# EAGLE design instrumentacion-eeg (EAGLE 9.6.2)
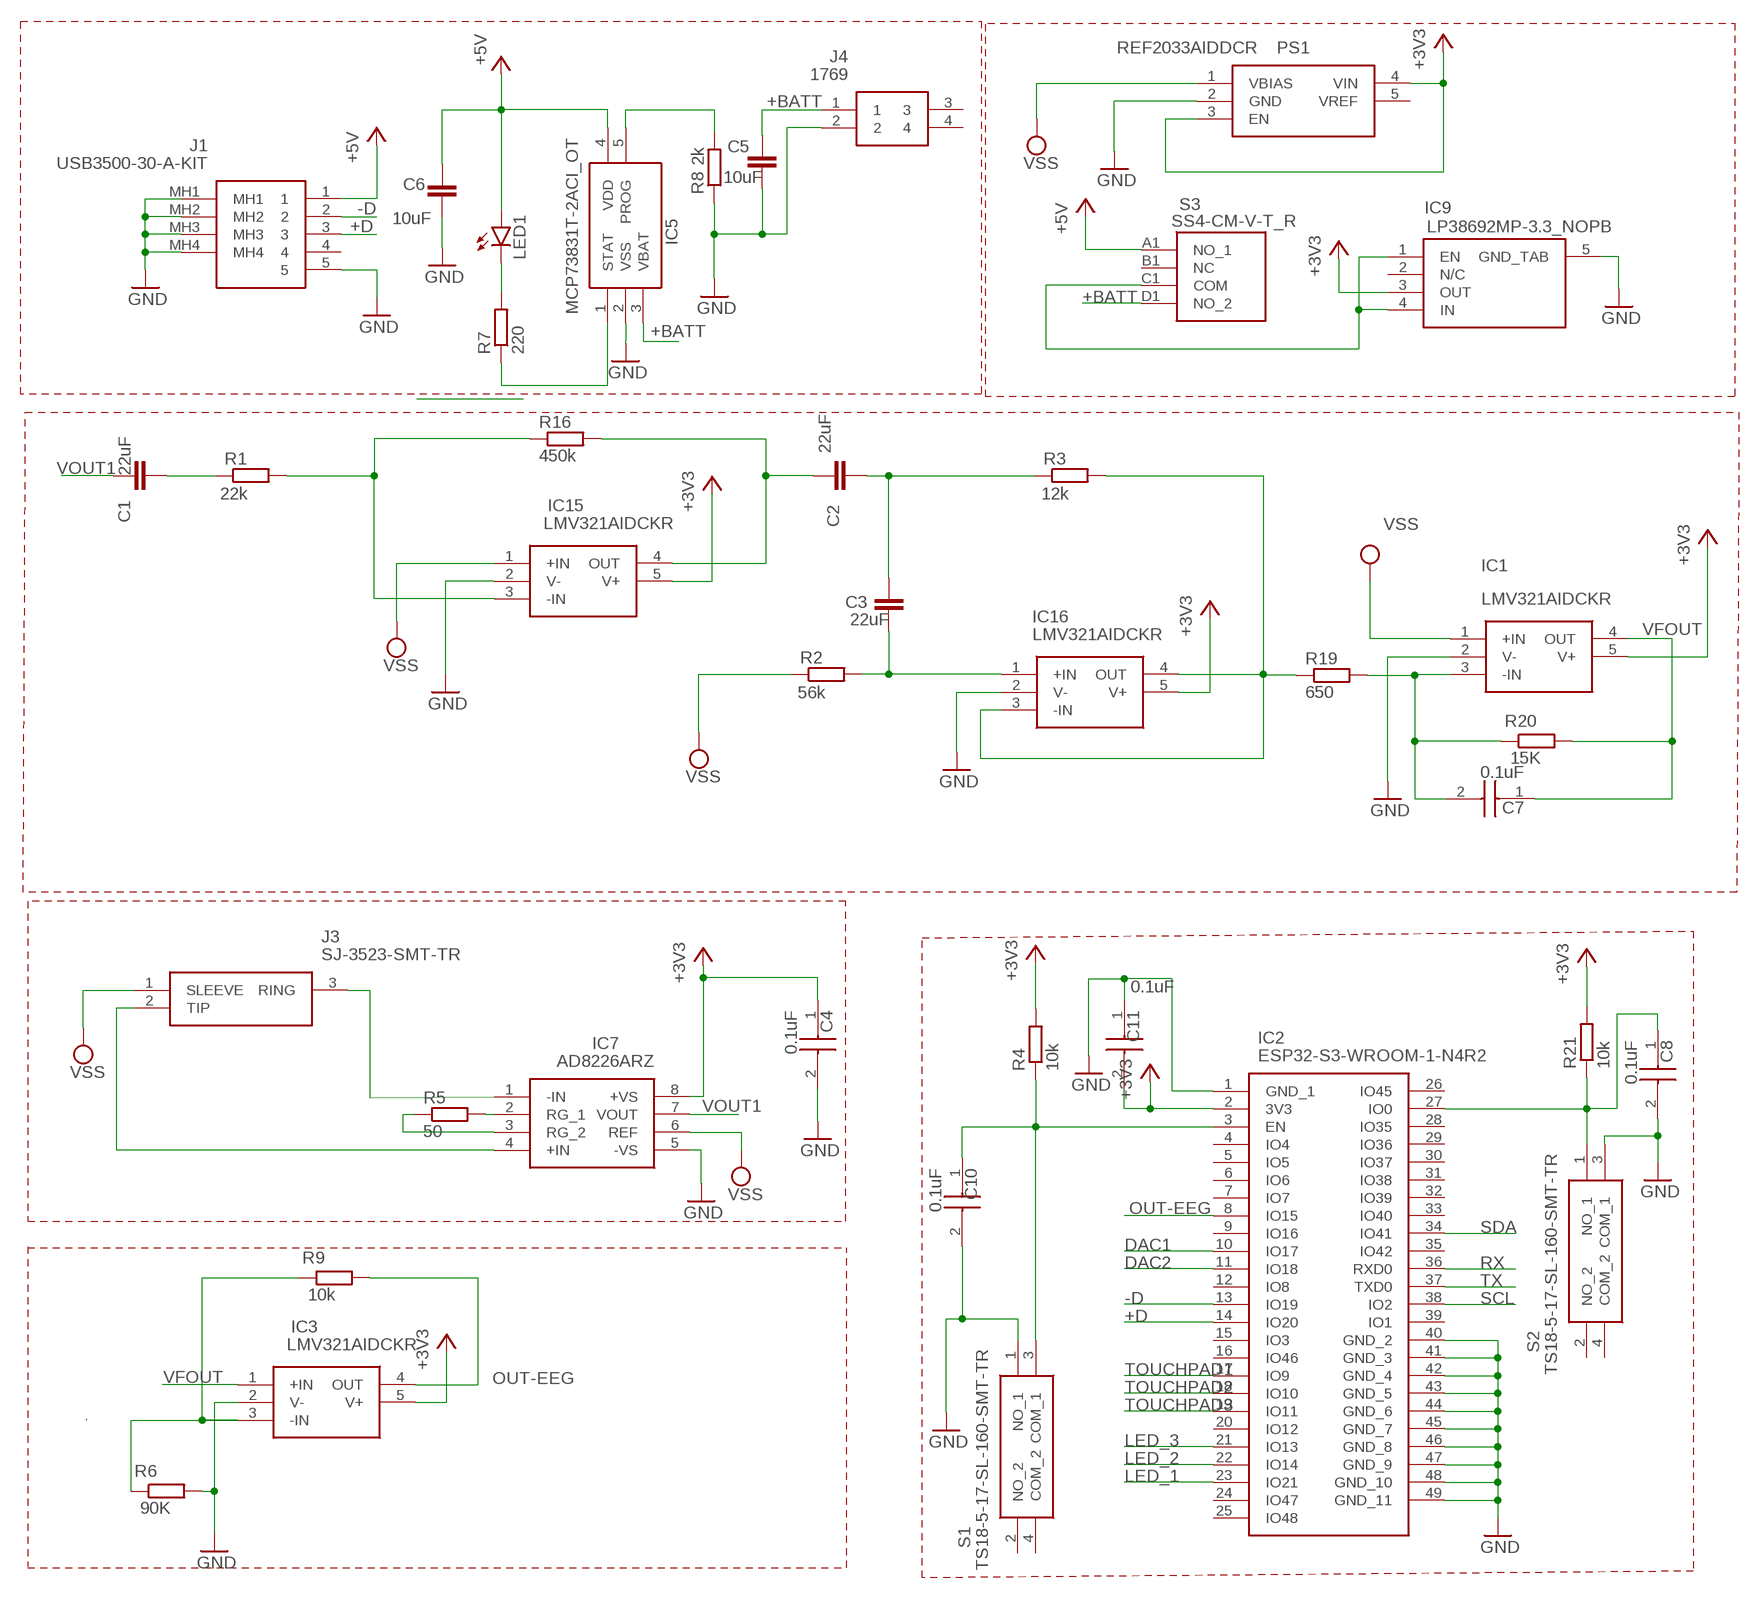
[diagram p0: schematic, sheet 1]

## Parts
C1  C-EUC0805  [C0805]
C2  C-EUC0805  [C0805]
C3  C-EUC0805  [C0805]
C4  0.1uF  GCM21B5C2A393JE02L  [CAPC2012X140N]
C5  C-EUC0805  [C0805]
C6  C-EUC0805  [C0805]
C7  0.1uF  GCM21B5C2A393JE02L  [CAPC2012X140N]
C8  0.1uF  GCM21B5C2A393JE02L  [CAPC2012X140N]
C10  0.1uF  GCM21B5C2A393JE02L  [CAPC2012X140N]
C11  0.1uF  GCM21B5C2A393JE02L  [CAPC2012X140N]
IC1  LMV321AIDCKR  [SOT65P210X110-5N]
IC2  ESP32-S3-WROOM-1-N4R2  [ESP32S3WROOM1N4R2]
IC3  LMV321AIDCKR  [SOT65P210X110-5N]
IC5  MCP73831T-2ACI_OT  [SOT95P270X145-5N]
IC7  AD8226ARZ  [SOIC127P600X175-8N]
IC9  LP38692MP-3.3_NOPB  [SOT150P700X180-5N]
IC15  LMV321AIDCKR  [SOT65P210X110-5N]
IC16  LMV321AIDCKR  [SOT65P210X110-5N]
J1  USB3500-30-A-KIT  [USB350030AKIT]
J3  SJ-3523-SMT-TR  [SJ3523SMTTR]
J4  1769  [1769]
LED1  LEDCHIP-LED0805  [CHIP-LED0805]
PS1  REF2033AIDDCR  [SOT95P280X110-5N]
R1  R-EU_R0805  [R0805]
R2  R-EU_R0805  [R0805]
R3  R-EU_R0805  [R0805]
R4  10k  R-EU_R0805  [R0805]
R5  50  R-EU_R0805  [R0805]
R6  90K  R-EU_R0805  [R0805]
R7  220  R-EU_R0805  [R0805]
R8  2k  R-EU_R0805  [R0805]
R9  10k  R-EU_R0805  [R0805]
R16  450k  R-EU_R0805  [R0805]
R19  650  R-EU_R0805  [R0805]
R20  15K  R-EU_R0805  [R0805]
R21  10k  R-EU_R0805  [R0805]
S1  TS18-5-17-SL-160-SMT-TR  [TS18517SL160SMTTR]
S2  TS18-5-17-SL-160-SMT-TR  [TS18517SL160SMTTR]
S3  SS4-CM-V-T_R  [SS4CMVTR]

## Nets
+3V3: C4.1 C11.2 IC1.5(V+) IC2.2(3V3) IC3.5(V+) IC7.8(+VS) IC9.3(OUT) IC15.5(V+) IC16.5(V+) PS1.3(EN) PS1.4(VIN) R4.2 R21.2
+5V: C6.2 IC5.4(VDD) J1.1 LED1.A S3.A1(NO_1)
+BATT: C5.2 IC5.3(VBAT) J4.1 S3.D1(NO_2)
+D: IC2.14(IO20) J1.3
-D: IC2.13(IO19) J1.2
DAC1: IC2.10(IO17)
DAC2: IC2.11(IO18)
GND: C4.2 C5.1 C6.1 C8.2 C10.2 C11.1 IC1.2(V-) IC2.1(GND_1) IC2.40(GND_2) IC2.41(GND_3) IC2.42(GND_4) IC2.43(GND_5) IC2.44(GND_6) IC2.45(GND_7) IC2.46(GND_8) IC2.47(GND_9) IC2.48(GND_10) IC2.49(GND_11) IC3.2(V-) IC5.2(VSS) IC7.5(-VS) IC9.5(GND_TAB) IC15.2(V-) IC16.2(V-) J1.5 J1.MH1 J1.MH2 J1.MH3 J1.MH4 J4.2 PS1.2(GND) R6.2 R8.1 S1.1(NO_1) S2.3(COM_1)
LED_1: IC2.23(IO21)
LED_2: IC2.22(IO14)
LED_3: IC2.21(IO13)
N$1: IC7.4(+IN) J3.2(TIP)
N$2: C1.2 R1.1
N$3: C3.1 IC16.1(+IN) R2.2
N$4: C2.2 C3.2 R3.1
N$5: C10.1 IC2.3(EN) R4.1 S1.3(COM_1)
N$6: IC16.3(-IN) IC16.4(OUT) R3.2 R19.1
N$9: C7.2 IC1.3(-IN) R19.2 R20.1
N$10: IC7.2(RG_1) R5.2
N$11: IC7.1(-IN) J3.3(RING)
N$12: IC7.3(RG_2) R5.1
N$13: C8.1 IC2.27(IO0) R21.1 S2.1(NO_1)
N$14: IC3.3(-IN) R6.1 R9.1
N$17: IC5.5(PROG) R8.2
N$19: IC5.1(STAT) R7.1
N$20: LED1.C R7.2
N$31: IC9.1(EN) IC9.4(IN) S3.C1(COM)
N$46: IC15.3(-IN) R1.2 R16.1
N$47: C2.1 IC15.4(OUT) R16.2
OUT-EEG: IC2.8(IO15) IC3.4(OUT) R9.2
RX: IC2.36(RXD0)
SCL: IC2.38(IO2)
SDA: IC2.34(IO41)
TOUCHPAD1: IC2.17(IO9)
TOUCHPAD2: IC2.18(IO10)
TOUCHPAD3: IC2.19(IO11)
TX: IC2.37(TXD0)
VFOUT: C7.1 IC1.4(OUT) IC3.1(+IN) R20.2
VOUT1: C1.1 IC7.7(VOUT)
VSS: IC1.1(+IN) IC7.6(REF) IC15.1(+IN) J3.1(SLEEVE) PS1.1(VBIAS) R2.1
Unconnected: IC2.4(IO4) IC2.5(IO5) IC2.6(IO6) IC2.7(IO7) IC2.9(IO16) IC2.12(IO8) IC2.15(IO3) IC2.16(IO46) IC2.20(IO12) IC2.24(IO47) IC2.25(IO48) IC2.26(IO45) IC2.28(IO35) IC2.29(IO36) IC2.30(IO37) IC2.31(IO38) IC2.32(IO39) IC2.33(IO40) IC2.35(IO42) IC2.39(IO1) IC9.2(N/C) J1.4 J4.3 J4.4 PS1.5(VREF) S1.2(NO_2) S1.4(COM_2) S2.2(NO_2) S2.4(COM_2) S3.B1(NC)

## Library data of the parts
C1-C3 C5 C6 = rcl:C-EU: CAPACITOR, European symbol; SPICEPREFIX: C
C4 C7 C8 C10 C11 = GCM21B5C2A393JE02L:GCM21B5C2A393JE02L: This specification is applied to Chip Multilayer Ceramic Capacitors. 1.Specific applications: Automotive Powertrain/Safety Equipment: Products that can be used for automotive equipment related to running, turning, stopping, safety devices, etc., or equipment whose structure, equipment, and performance are legally required to meet technical standards for safety assurance or environmental protection. Automotive Infotainment/Comfort Equipment: Products that can be used for automotive equipment such as c Source: Datasheet <https://search.murata.co.jp/Ceramy/image/img/A01X/G101/ENG/GCM21B5C2A393JE02-01A.pdf>; DESCRIPTION: This specification is applied to Chip Multilayer Ceramic Capacitors. 1.Specific applications: Automotive Powertrain/Safety Equipment: Products that can be used for automotive equipment related to running, turning, stopping, safety devices, etc., or equipment whose structure, equipment, and performance are legally required to meet technical standards for safety assurance or environmental protection. Automotive Infotainment/Comfort Equipment: Products that can be used for automotive equipment such as c; HEIGHT: 1.4mm; MANUFACTURER_NAME: Murata Electronics; MANUFACTURER_PART_NUMBER: GCM21B5C2A393JE02L; MOUSER_PART_NUMBER: 81-GCM21B5C2A393JE2L; MOUSER_PRICE-STOCK: https://www.mouser.co.uk/ProductDetail/Murata-Electronics/GCM21B5C2A393JE02L?qs=efUn273yAheACf9Thh026A%3D%3D
IC1 IC3 IC15 IC16 = LMV321AIDCKR:LMV321AIDCKR: Single Low-Voltage, Cost-Optimized Rail-to-Rail Output Operational Amplifier Source: Datasheet <http://www.ti.com/lit/gpn/LMV321A>; DESCRIPTION: Single Low-Voltage, Cost-Optimized Rail-to-Rail Output Operational Amplifier; HEIGHT: 1.1mm; MANUFACTURER_NAME: Texas Instruments; MANUFACTURER_PART_NUMBER: LMV321AIDCKR; MOUSER_PART_NUMBER: 595-LMV321AIDCKR; MOUSER_PRICE-STOCK: https://www.mouser.co.uk/ProductDetail/Texas-Instruments/LMV321AIDCKR?qs=%252BEew9%252B0nqrDxZ%2F4fDfzAtQ%3D%3D
IC2 = ESP32-S3-WROOM-1-N4R2:ESP32-S3-WROOM-1-N4R2: Bluetooth, WiFi 802.11b/g/n, Bluetooth v5.0 Transceiver Module 2.4GHz PCB Trace Surface Mount , 3V ~ 3.6V , 285mA ~ 355mA , -40C ~ 85C (TA) Source: Datasheet <https://www.espressif.com/sites/default/files/documentation/esp32-s3-wroom-1_wroom-1u_datasheet_en.pdf>; DESCRIPTION: Bluetooth, WiFi 802.11b/g/n, Bluetooth v5.0 Transceiver Module 2.4GHz PCB Trace Surface Mount , 3V ~ 3.6V , 285mA ~ 355mA , -40C ~ 85C (TA); HEIGHT: 3.25mm; MANUFACTURER_NAME: Espressif Systems; MANUFACTURER_PART_NUMBER: ESP32-S3-WROOM-1-N4R2; MOUSER_PART_NUMBER: 356-ESP32S3WROM1N4R2; MOUSER_PRICE-STOCK: https://www.mouser.co.uk/ProductDetail/Espressif-Systems/ESP32-S3-WROOM-1-N4R2?qs=Li%252BoUPsLEns3eX9krmrDyw%3D%3D
IC5 = MCP73831T-2ACI_OT:MCP73831T-2ACI_OT: Li-Ion Charge Controller 4.2V SOT23-5 Source: Datasheet <http://ww1.microchip.com/downloads/en/DeviceDoc/20001984g.pdf>; DESCRIPTION: Li-Ion Charge Controller 4.2V SOT23-5; HEIGHT: 1.45mm; MANUFACTURER_NAME: Microchip; MANUFACTURER_PART_NUMBER: MCP73831T-2ACI/OT; MOUSER_PART_NUMBER: 579-MCP73831T-2ACIOT; MOUSER_PRICE-STOCK: https://www.mouser.co.uk/ProductDetail/Microchip-Technology/MCP73831T-2ACI-OT?qs=yUQqVecv4qvbBQBGbHx0Mw%3D%3D
IC7 = AD8226ARZ:AD8226ARZ: Wide Supply Range, Rail-to-Rail Output Instrumentation Amplifier Source: Datasheet <http://componentsearchengine.com/Datasheets/3/AD8226ARZ.pdf>; DESCRIPTION: Wide Supply Range, Rail-to-Rail Output Instrumentation Amplifier; HEIGHT: 1.75mm; MANUFACTURER_NAME: Analog Devices; MANUFACTURER_PART_NUMBER: AD8226ARZ; MOUSER_PART_NUMBER: 584-AD8226ARZ; MOUSER_PRICE-STOCK: https://www.mouser.co.uk/ProductDetail/Analog-Devices/AD8226ARZ?qs=%2FtpEQrCGXCzihJADRPlhCg%3D%3D
IC9 = LP38692MP-3.3_NOPB:LP38692MP-3.3_NOPB: LP38692MP-3.3/NOPB, Low Dropout Voltage Regulator, 1A, 3.3 V +/-2.5%, 2.7 10 Vin, 5-Pin SOT-223 Source: Datasheet <http://www.ti.com/lit/ds/symlink/lp38692.pdf>; DESCRIPTION: LP38692MP-3.3/NOPB, Low Dropout Voltage Regulator, 1A, 3.3 V +/-2.5%, 2.7 10 Vin, 5-Pin SOT-223; HEIGHT: 1.8mm; MANUFACTURER_NAME: Texas Instruments; MANUFACTURER_PART_NUMBER: LP38692MP-3.3/NOPB; MOUSER_PART_NUMBER: 926-LP38692MP3.3NOPB; MOUSER_PRICE-STOCK: https://www.mouser.co.uk/ProductDetail/Texas-Instruments/LP38692MP-3.3-NOPB?qs=1FNqv8aZn1TpKuOP2NKBdg%3D%3D
J1 = USB3500-30-A-KIT:USB3500-30-A-KIT: USB Connectors Micro B Skt, Mid Mount-SMT, R/A, 30u", With Peg, T&R, IP67 + USBTJ-02 Gasket Source: Datasheet <https://gct.co/files/drawings/usb3500.pdf>; DESCRIPTION: USB Connectors Micro B Skt, Mid Mount-SMT, R/A, 30u", With Peg, T&R, IP67 + USBTJ-02 Gasket; HEIGHT: 2.8mm; MANUFACTURER_NAME: GCT (GLOBAL CONNECTOR TECHNOLOGY); MANUFACTURER_PART_NUMBER: USB3500-30-A-KIT; MOUSER_PART_NUMBER: 640-USB3500-30-A-KIT; MOUSER_PRICE-STOCK: https://www.mouser.co.uk/ProductDetail/GCT/USB3500-30-A-KIT?qs=KUoIvG%2F9IlZmD2kH2DfgYg%3D%3D
J3 = SJ-3523-SMT-TR:SJ-3523-SMT-TR: 3.5 mm, Stereo, Right Angle, Surface Mount (SMT), 3 Conductors, 0 Internal Switches, Audio Jack Connector Source: Datasheet <https://www.sameskydevices.com/product/resource/supplyframepdf/sj-352x-smt.pdf>; DESCRIPTION: 3.5 mm, Stereo, Right Angle, Surface Mount (SMT), 3 Conductors, 0 Internal Switches, Audio Jack Connector; HEIGHT: 5.2mm; MANUFACTURER_NAME: Same Sky; MANUFACTURER_PART_NUMBER: SJ-3523-SMT-TR; MOUSER_PART_NUMBER: 490-SJ-3523-SMT-TR; MOUSER_PRICE-STOCK: https://www.mouser.co.uk/ProductDetail/CUI-Devices/SJ-3523-SMT-TR?qs=WyjlAZoYn51zOHzJ3r4ZRA%3D%3D
J4 = 1769:1769: Adafruit Accessories JST-PH 2-pin SMT Right Angle Connect Source: Datasheet <https://cdn-shop.adafruit.com/datasheets/17311.pdf>; ARROW_PART_NUMBER: 1769; ARROW_PRICE-STOCK: https://www.arrow.com/en/products/1769/adafruit-industries?utm_currency=USD&region=nac; DESCRIPTION: Adafruit Accessories JST-PH 2-pin SMT Right Angle Connect; HEIGHT: 5.5mm; MANUFACTURER_NAME: Adafruit; MANUFACTURER_PART_NUMBER: 1769; MOUSER_PART_NUMBER: 485-1769; MOUSER_PRICE-STOCK: https://www.mouser.co.uk/ProductDetail/Adafruit/1769?qs=GURawfaeGuBbgoGtf2XstA%3D%3D
LED1 = led:LED: LED OSRAM: - CHIPLED LG R971, LG N971, LY N971, LG Q971, LY Q971, LO R971, LY R971 LH N974, LH R974 LS Q976, LO Q976, LY Q976 LO Q996 - Hyper CHIPLED LW Q18S LB Q993, LB Q99A, LB R99A - SideLED LS A670, LO A670, LY A670, LG A670, LP A670 LB A673, LV A673, LT A673, LW A673 LH A674 LY A675 LS A676, LA A676, LO A676, LY A676, LW A676 LS A679, LY A679, LG A679 - Hyper Micro SIDELED® LS Y876, LA Y876, LO Y876, LY Y876 LT Y87S - SmartLED LW L88C, LW L88S LB L89C, LB L89S, LG L890 LS L89K, LO L89K, LY L89K LS L896, LA L896, LO L896, LY L896 - TOPLED LS T670, LO T670, LY T670, LG T670, LP T670 LSG T670, LSP T670, LSY T670, LOP T670, LYG T670 LG T671, LOG T671, LSG T671 LB T673, LV T673, LT T673, LW T673 LH T674 LS T676, LA T676, LO T676, LY T676, LB T676, LH T676, LSB T676, LW T676 LB T67C, LV T67C, LT T67C, LS T67K, LO T67K, LY T67K, LW E67C LS E67B, LA E67B, LO E67B, LY E67B, LB E67C, LV E67C, LT E67C LW T67C LS T679, LY T679, LG T679 LS T770, LO T770, LY T770, LG T770, LP T770 LB T773, LV T773, LT T773, LW T773 LH T774 LS E675, LA E675, LY E675, LS T675 LS T776, LA T776, LO T776, LY T776, LB T776 LHGB T686 LT T68C, LB T68C - Hyper Mini TOPLED® LB M676 - Mini TOPLED Santana® LG M470 LS M47K, LO M47K, LY M47K Source: http://www.osram.convergy.de LUXEON: - LUMILED® LXK2-PW12-R00, LXK2-PW12-S00, LXK2-PW14-U00, LXK2-PW14-V00 LXK2-PM12-R00, LXK2-PM12-S00, LXK2-PM14-U00 LXK2-PE12-Q00, LXK2-PE12-R00, LXK2-PE12-S00, LXK2-PE14-T00, LXK2-PE14-U00 LXK2-PB12-K00, LXK2-PB12-L00, LXK2-PB12-M00, LXK2-PB14-N00, LXK2-PB14-P00, LXK2-PB14-Q00 LXK2-PR12-L00, LXK2-PR12-M00, LXK2-PR14-Q00, LXK2-PR14-R00 LXK2-PD12-Q00, LXK2-PD12-R00, LXK2-PD12-S00 LXK2-PH12-R00, LXK2-PH12-S00 LXK2-PL12-P00, LXK2-PL12-Q00, LXK2-PL12-R00 Source: www.luxeon.com KINGBRIGHT: KA-3528ASYC Source: www.kingbright.com
PS1 = REF2033AIDDCR:REF2033AIDDCR: Low-Drift, Low-Power, Dual-Output Vref and Vref/2 Voltage Reference Source: Datasheet <http://www.ti.com/lit/ds/symlink/ref2033.pdf>; DESCRIPTION: Low-Drift, Low-Power, Dual-Output Vref and Vref/2 Voltage Reference; HEIGHT: 1.1mm; MANUFACTURER_NAME: Texas Instruments; MANUFACTURER_PART_NUMBER: REF2033AIDDCR; MOUSER_PART_NUMBER: 595-REF2033AIDDCR; MOUSER_PRICE-STOCK: https://www.mouser.co.uk/ProductDetail/Texas-Instruments/REF2033AIDDCR?qs=7z%252BmIopC6%2FKHHOBVNaL7UQ%3D%3D
R1-R9 R16 R19-R21 = rcl:R-EU_: RESISTOR, European symbol; SPICEPREFIX: R
S1 = TS18-5-17-SL-160-SMT-TR:TS18-5-17-SL-160-SMT-TR: 5 x 5 mm, 1.7 mm Actuator Height, 160 gf, Silver, Surface Mount, TR, SPST, Tactile Switch Source: Datasheet <https://www.sameskydevices.com/product/resource/supplyframepdf/ts18.pdf>; DESCRIPTION: 5 x 5 mm, 1.7 mm Actuator Height, 160 gf, Silver, Surface Mount, TR, SPST, Tactile Switch; HEIGHT: 1.8mm; MANUFACTURER_NAME: Same Sky; MANUFACTURER_PART_NUMBER: TS18-5-17-SL-160-SMT-TR; MOUSER_PART_NUMBER: 179-TS18517SL160SMTT; MOUSER_PRICE-STOCK: https://www.mouser.co.uk/ProductDetail/CUI-Devices/TS18-5-17-SL-160-SMT-TR?qs=tlsG%2FOw5FFhWy38y3t272A%3D%3D
S2 = TS18-5-17-SL-160-SMT-TR:TS18-5-17-SL-160-SMT-TR: 5 x 5 mm, 1.7 mm Actuator Height, 160 gf, Silver, Surface Mount, TR, SPST, Tactile Switch Source: Datasheet <https://www.sameskydevices.com/product/resource/supplyframepdf/ts18.pdf>; DESCRIPTION: FLASH; HEIGHT: 1.8mm; MANUFACTURER_NAME: Same Sky; MANUFACTURER_PART_NUMBER: TS18-5-17-SL-160-SMT-TR; MOUSER_PART_NUMBER: 179-TS18517SL160SMTT; MOUSER_PRICE-STOCK: https://www.mouser.co.uk/ProductDetail/CUI-Devices/TS18-5-17-SL-160-SMT-TR?qs=tlsG%2FOw5FFhWy38y3t272A%3D%3D
S3 = SS4-CM-V-T_R:SS4-CM-V-T_R: Slide Switches Slide Type 1P3T (2.0mm height) Source: Datasheet <https://componentsearchengine.com/Datasheets/1/SS4-CM-V-T_R.pdf>; DESCRIPTION: Slide Switches Slide Type 1P3T (2.0mm height); HEIGHT: 2mm; MANUFACTURER_NAME: Diptronics; MANUFACTURER_PART_NUMBER: SS4-CM-V-T/R; MOUSER_PART_NUMBER: 113-SS4CMVTR; MOUSER_PRICE-STOCK: https://www.mouser.co.uk/ProductDetail/Diptronics/SS4-CM-V-T-R?qs=MLItCLRbWswqNEU%2F6grMKg%3D%3D

## Module NOINVERSOR
Ports: 

### Library data of the parts

## Board
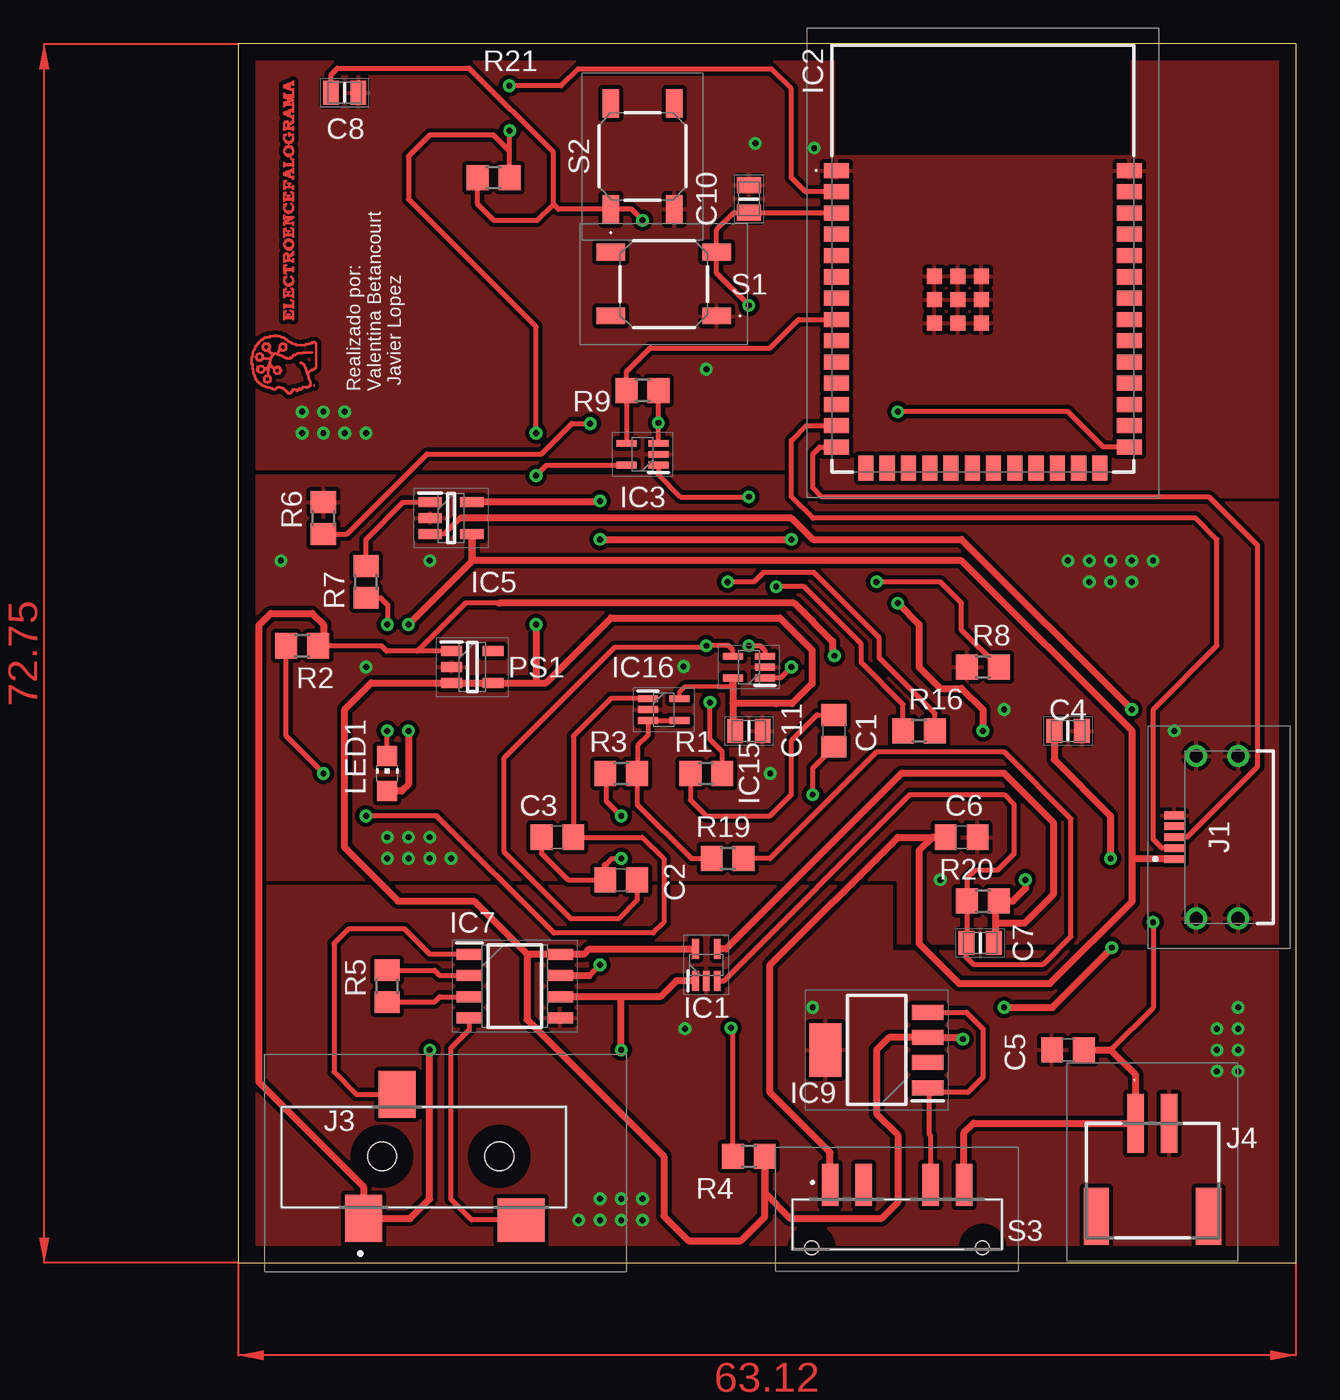
[diagram p1: board, top side]
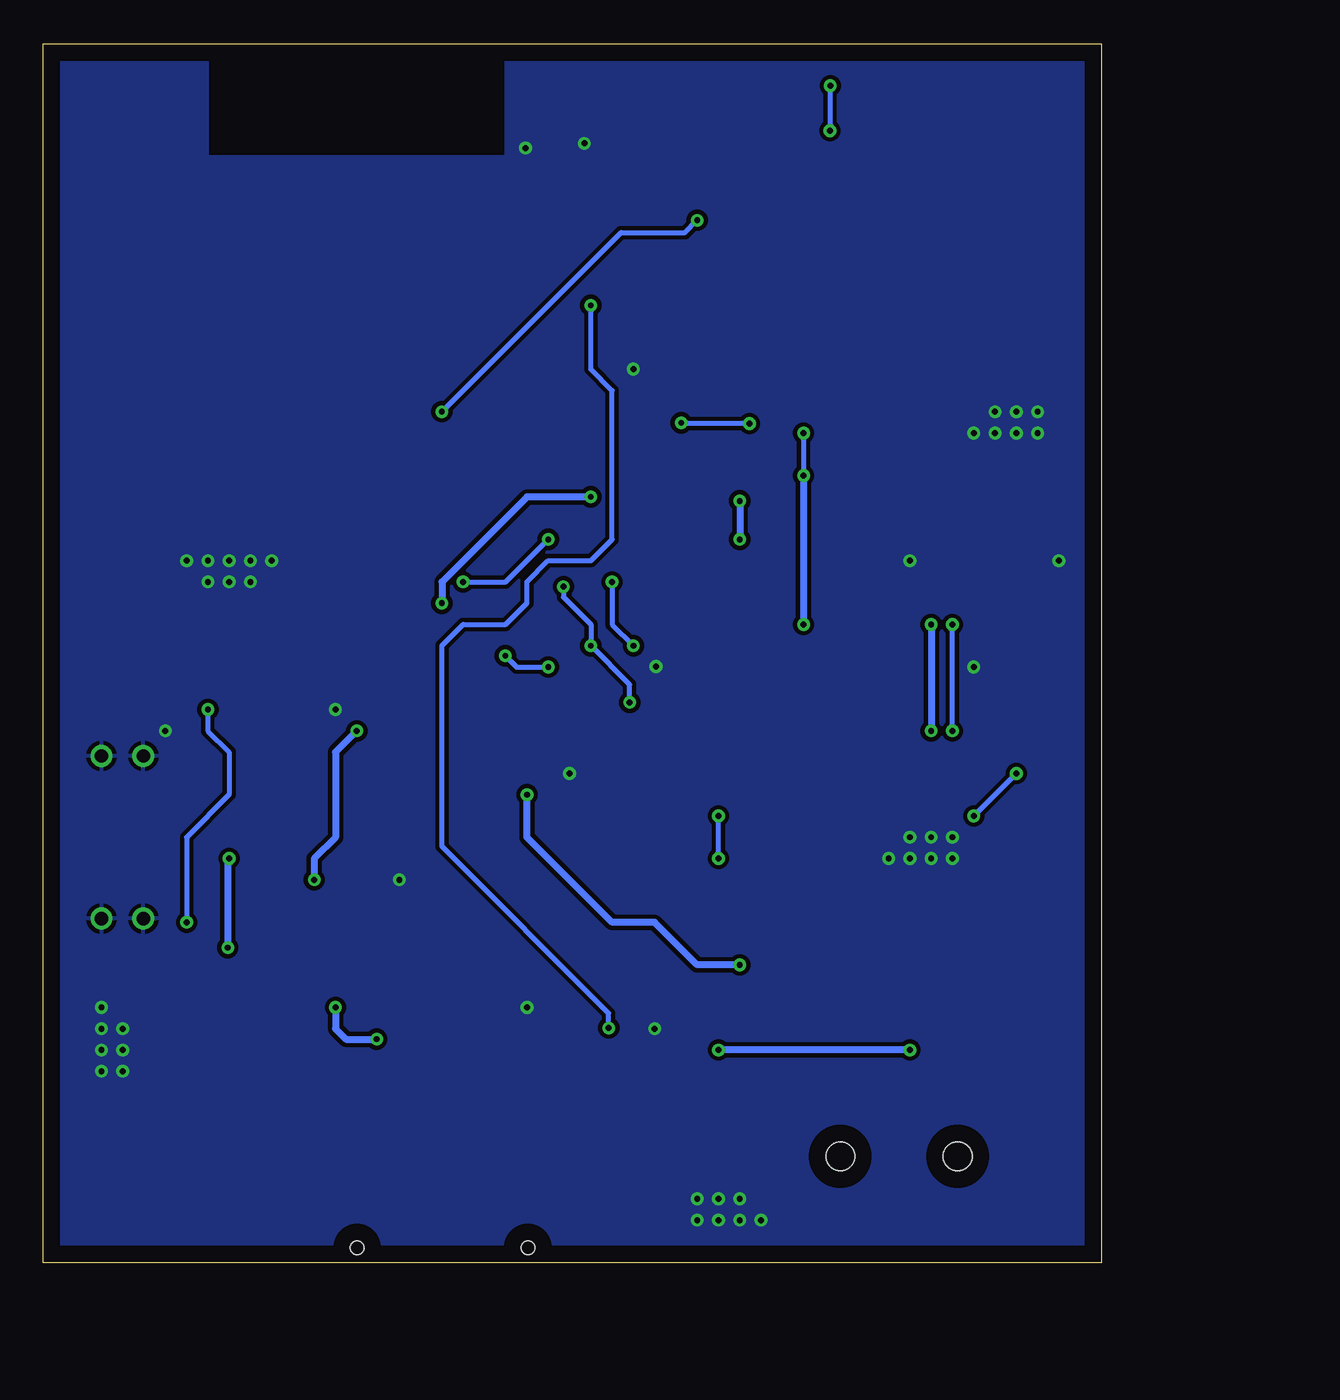
[diagram p2: board, bottom side, seen from below]

Size 63.17 x 72.76 mm. Coordinates in mm from the lower left corner, seen from the top.
Outline: 0,0 63.17,0 63.16,72.76 0,72.76 0,0
Copper layers (1*16): Top 0.035mm / dielectric 1.5mm / Bottom 0.035mm
Design rules "default": minimum track width 6mil, minimum drill 0.35mm, track to track 6mil, track to pad 6mil, pad to pad 6mil, via to via 6mil, smd to smd 6mil, copper to edge 40mil, drill to drill 6mil, minimum pad ring 10mil, minimum via ring 8mil, stop-mask expansion 4mil, vias tented up to drill 0mil, thermal gap 10mil

### Footprints (pad centres in the part's own frame; a part is rotated, then mirrored left to right if it is on the bottom)
C0805 = smd 1.3 x 1.5: 1 -0.95,0; 2 0.95,0
CAPC2012X140N = smd 0.94 x 1.43: 1 -0.82,0; 2 0.82,0
SOT65P210X110-5N = smd 1.2 x 0.4: 1 -0.95,0.65; 2 -0.95,0; 3 -0.95,-0.65; 4 0.95,-0.65; 5 0.95,0.65
ESP32S3WROOM1N4R2 = smd 1.5 x 0.9: 1 -8.75,5.51; 2 -8.75,4.24; 3 -8.75,2.97; 4 -8.75,1.7; 5 -8.75,0.43; 6 -8.75,-0.84; 7 -8.75,-2.11; 8 -8.75,-3.38; 9 -8.75,-4.65; 10 -8.75,-5.92; 11 -8.75,-7.19; 12 -8.75,-8.46; 13 -8.75,-9.73; 14 -8.75,-11; 27 8.75,-11; 28 8.75,-9.73; 29 8.75,-8.46; 30 8.75,-7.19; 31 8.75,-5.92; 32 8.75,-4.65; 33 8.75,-3.38; 34 8.75,-2.11; 35 8.75,-0.84; 36 8.75,0.43; 37 8.75,1.7; 38 8.75,2.97; 39 8.75,4.24; 40 8.75,5.51 | smd 0.9 x 1.5: 15 -6.985,-12.25; 16 -5.715,-12.25; 17 -4.445,-12.25; 18 -3.175,-12.25; 19 -1.905,-12.25; 20 -0.635,-12.25; 21 0.635,-12.25; 22 1.905,-12.25; 23 3.175,-12.25; 24 4.445,-12.25; 25 5.715,-12.25; 26 6.985,-12.25 | smd 0.9 x 0.9: 41 -1.5,-2.21; 42 -0.1,-2.21; 43 -0.1,-0.81; 44 -1.5,-0.81; 45 -2.9,-0.81; 46 -2.9,-2.21; 47 -2.9,-3.61; 48 -1.5,-3.61; 49 -0.1,-3.61
SOT95P270X145-5N = smd 1.4 x 0.6: 1 -1.25,0.95; 2 -1.25,0; 3 -1.25,-0.95; 4 1.25,-0.95; 5 1.25,0.95
SOIC127P600X175-8N = smd 1.525 x 0.65: 1 -2.712,1.905; 2 -2.712,0.635; 3 -2.712,-0.635; 4 -2.712,-1.905; 5 2.712,-1.905; 6 2.712,-0.635; 7 2.712,0.635; 8 2.712,1.905
SOT150P700X180-5N = smd 1.9 x 0.9: 1 -3.05,2.25; 2 -3.05,0.75; 3 -3.05,-0.75; 4 -3.05,-2.25 | smd 1.9 x 3.2: 5 3.05,0
USB350030AKIT = smd 0.45 x 1.2: 1 -1.3,3.8; 2 -0.65,3.8; 3 0,3.8; 4 0.65,3.8; 5 1.3,3.8 | drill 0.8 pad 1.2: MH1 -4.85,2.5; MH2 4.85,2.5; MH3 -4.85,0; MH4 4.85,0
SJ3523SMTTR = smd 2.2 x 2.8: 1 2.4,-3.7; 3 4.4,3.7 | smd 2.8 x 2.6: 2 11.8,-3.8 | hole 1.7: 3.5,0; 10.5,0
1769 = smd 1 x 3.5: 1 -1,0; 2 1,0 | smd 1.5 x 3.4: 3 -3.35,-5.55; 4 3.35,-5.55
CHIP-LED0805 = smd 1.2 x 1.2: A 0,-1.05; C 0,1.05
SOT95P280X110-5N = smd 1.25 x 0.6: 1 -1.25,0.95; 2 -1.25,0; 3 -1.25,-0.95; 4 1.25,-0.95; 5 1.25,0.95
R0805 = smd 1.3 x 1.5: 1 -0.95,0; 2 0.95,0
TS18517SL160SMTTR = smd 1.7 x 1: 1 -3.15,1.9; 2 3.15,1.9; 3 -3.15,-1.9; 4 3.15,-1.9
SS4CMVTR = smd 1 x 2.5: A1 -4,2.35; B1 -2,2.35; C1 2,2.35; D1 4,2.35 | hole 0.8: -5.1,-1.4; 5.1,-1.4

### Placement (x,y rotation side)
C1  35.56,31.75 90 top
C2  22.86,22.86 180 top
C3  19.05,25.4 180 top
C4  49.53,31.75 0 top
C5  49.53,12.7 0 top
C6  43.18,25.4 180 top
C7  44.29,19.09 180 top
C8  6.35,69.85 0 top
C10  30.48,63.5 90 top
C11  30.48,31.75 180 top
IC1  27.94,17.78 90 top
IC2  44.45,59.69 0 top
IC3  24.13,48.26 180 top
IC5  12.7,44.45 0 top
IC7  16.51,16.51 0 top
IC9  38.1,12.7 180 top
IC15  30.48,35.56 180 top
IC16  25.4,33.02 0 top
J1  59.69,25.4 90 top
J3  5.08,6.35 0 top
J4  54.57,8.32 0 top
LED1  8.89,29.21 0 top
PS1  13.97,35.56 0 top
R1  27.94,29.21 0 top
R2  3.81,36.83 180 top
R3  22.86,29.21 0 top
R4  30.48,6.35 0 top
R5  8.89,16.51 90 top
R6  5.08,44.45 90 top
R7  7.62,40.64 270 top
R8  44.45,35.56 0 top
R9  24.13,52.07 180 top
R16  40.64,31.75 0 top
R19  29.21,24.13 0 top
R20  44.45,21.59 0 top
R21  15.24,64.77 0 top
S1  25.4,58.42 180 top
S2  24.13,66.04 90 top
S3  39.33,2.3 0 top

### Tracks (layer width: path | path; a pad name or v marks a point on that pad's centre or on a via)
+3V3  (via drill 0.35)
  Top 0.152: 17.78,34.61 PS1.4
  Top 0.254: IC16.5 26.35,34.07 26.66,34.38 29.53,34.38
  Top 0.305: v17.78,49.53 17.78,55.88 10.16,63.5 10.16,66.04 11.43,67.31 15.24,67.31 16.19,66.36 R21.2 16.19,67.56 v16.2,67.58 | v17.78,46.99 18.4,47.61 IC3.5 | IC2.2 33.86,63.93 33.02,64.77 33.02,70.07 31.83,71.26 20.28,71.26 19.28,70.26 v16.18,70.26 | 32.12,33.38 32.12,33.39
  Top 0.406: IC1.5 27.25,18.69 20.91,18.69 20.64,18.41 IC7.8 17.24,18.41 17.24,18.42 | 17.24,18.42 17.24,14.51 25.4,6.35 25.4,2.78 26.87,1.31 30,1.31 31.43,2.75 R4.2 31.43,4.17 32.97,2.63 38.38,2.63 39.37,3.62 39.37,7.62 38.1,8.89 38.1,12.7 38.85,13.45 IC9.3 43.16,13.45 v43.26,13.35 | 29.53,34.38 IC15.5 29.53,33.39 | C11.2 29.53,31.88 29.53,33.39 | C4.1 48.71,30.03 52.07,26.67 v52.07,24.13 | v45.72,15.24 48.6,15.24 52.15,18.79 v52.15,18.81 | v17.78,38.1 17.78,34.61 | 32.12,33.39 29.53,33.39 | 32.12,33.38 33.05,33.38 34.25,34.57 34.25,36.57 32.33,38.49 22.24,38.49 18.36,34.61 PS1.4 PS1.3 7.94,34.61 6.35,33.02 6.35,24.78 9.54,21.59 14.07,21.59 17.24,18.42
  Bottom 0.305: v17.78,49.53 v17.78,46.99 | v16.18,70.26 16.2,70.24 v16.2,67.58
  Bottom 0.406: v45.72,15.24 45.72,13.97 45.1,13.35 v43.26,13.35 | v52.07,24.13 52.15,24.05 v52.15,18.81 | v17.78,46.99 v17.78,38.1
+5V  (via drill 0.35)
  Top 0.406: S3.A1 35.33,6.58 31.75,10.16 31.75,17.78 39.37,25.4 C6.2 41.42,25.4 40.64,24.62 40.64,19.05 43.03,16.66 48.45,16.66 53.36,21.57 53.36,24.08 | 53.36,24.08 53.36,31.73 43.18,41.91 13.97,41.91 13.95,41.93 IC5.4 13.95,41.89 v10.16,38.1 | v10.16,31.75 10.16,28.56 9.76,28.16 LED1.A | J1.1 53.38,24.1 53.36,24.08
  Bottom 0.406: v10.16,38.1 v10.16,31.75
+BATT  (via drill 0.35)
  Top 0.305: v54.61,20.32 54.61,15.22 52.09,12.7 | IC5.3 12.29,43.5 13.24,44.45
  Top 0.406: S3.D1 43.33,7.77 43.88,8.32 J4.1 53.57,11.2 52.07,12.7 | 52.07,12.7 52.09,12.7 | C5.2 52.07,12.7 | 13.24,44.45 33.02,44.45 34.29,43.18 43.18,43.18 v53.34,33.02
  Bottom 0.305: v53.34,33.02 53.34,31.75 52.07,30.48 52.07,27.94 54.61,25.4 v54.61,20.32
+D
  Top 0.305: J1.3 56.62,25.4 60.85,29.64 60.85,42.83 57.96,45.72 34.83,45.72 34.29,46.26 34.29,48.26 34.72,48.69 IC2.14
-D
  Top 0.305: J1.2 55.14,24.75 54.61,25.28 54.61,33.02 58.42,36.83 58.42,43.18 57.15,44.45 34.29,44.45 33.02,45.72 33.02,49.09 33.89,49.96 IC2.13
GND  (via drill 0.35)
  other vias: 8.89,24.13 10.16,24.13 11.43,24.13 12.7,24.13 11.43,25.4 10.16,25.4 8.89,25.4 20.32,2.54 21.59,2.54 22.86,2.54 21.59,3.81 22.86,3.81 24.13,3.81 24.13,2.54 3.81,49.53 5.08,49.53 6.35,49.53 7.62,49.53 6.35,50.8 5.08,50.8 3.81,50.8 59.69,15.24 59.69,12.7 59.69,13.97 58.42,13.97 58.42,12.7 58.42,11.43 59.69,11.43 49.53,41.91 50.8,41.91 52.07,41.91 53.34,41.91 54.61,41.91 53.34,40.64 52.07,40.64 50.8,40.64 31.75,29.21 2.54,41.91 11.43,41.91 27.94,53.34 34.29,15.24 26.67,13.97 45.72,33.02 55.88,31.75 41.91,22.86 7.62,35.56 30.87,66.82 34.38,66.54 26.58,35.59
  pour Top (isolate 0.254): 0,22.48 39.03,22.48 39.03,18.59 62.23,18.59 62.23,0 0,0
  pour Top (isolate 0.254): 0,46.99 32.68,46.99 32.68,45.38 62.23,45.38 62.23,19.05 39.37,19.05 39.37,22.86 0,22.86
  pour Top (isolate 0.254): 0.04,72.77 35.56,72.77 35.56,66.04 53.34,66.04 53.34,72.77 63.16,72.77 63.16,45.72 33.02,45.72 33.02,47.37 0.04,47.37
  pour Bottom (isolate 0.254): 0,72.75 35.56,72.75 35.56,66.04 53.34,66.04 53.34,72.64 63.12,72.64 63.12,0 0,0
N$1
  Top 0.305: J3.2 13.94,2.55 12.7,3.79 12.7,12.82 13.8,13.92 IC7.4
N$2
  Top 0.305: R1.1 26.99,27.62 27.94,26.67 31.75,26.67 33.02,27.94 33.02,31.17 34.55,32.7 C1.2
N$3  (via drill 0.35)
  Top 0.305: IC16.1 22.24,33.67 20,31.43 C3.1 24.13,25.4 25.4,24.13 25.4,20.32 24.76,19.68 18.84,19.68 11.85,26.67 v7.62,26.67 | v5.08,29.21 2.86,31.43 R2.2
  Bottom 0.305: v7.62,26.67 v5.08,29.21
N$4  (via drill 0.35)
  Top 0.305: 21.91,23.49 C2.2 19.67,22.86 18.1,24.43 C3.2 | 21.91,23.75 22.29,24.13 v22.86,24.13 | v22.86,26.67 21.95,27.58 21.95,29.21 R3.1
  Top 0.406: C2.2 21.91,23.75
  Bottom 0.305: v22.86,24.13 v22.86,26.67
N$5  (via drill 0.35)
  Top 0.305: C10.1 30.5,62.66 IC2.3 29.55,62.66 28.55,61.66 S1.3 28.55,59.08 v30.48,57.15 | R4.1 29.49,6.39 29.49,13.93 v29.41,14.01
  Bottom 0.305: v29.41,14.01 29.41,14.89 39.37,24.85 39.37,36.83 38.1,38.1 35.56,38.1 34.29,39.37 34.29,40.64 33.02,41.91 30.48,41.91 29.21,43.18 29.21,52.07 30.48,53.34 v30.48,57.15
N$6
  Top 0.305: IC16.4 IC16.3 24.45,31.48 23.84,30.88 23.84,29.24 R3.2 23.81,27.37 27.05,24.13 R19.1
N$9
  Top 0.305: R19.2 31.75,24.13 38.1,30.48 45.72,30.48 49.71,26.49 49.71,19.47 48.02,17.78 43.91,17.78 43.47,18.22 C7.2 43.5,19.12 R20.1 43.5,22.93 43.97,23.39 44,23.39 44.04,23.43 45.33,23.43 46.3,24.41 46.3,27.36 45.72,27.94 40.1,27.94 28.99,16.83 IC1.3
N$10
  Top 0.305: R5.2 11.71,17.46 12.02,17.14 IC7.2
N$11
  Top 0.305: IC7.1 11.44,18.41 9.94,19.92 6.58,19.92 5.71,19.05 5.71,11.39 7.05,10.05 J3.3
N$12
  Top 0.305: R5.1 11.71,15.56 12.02,15.88 IC7.3
N$13  (via drill 0.35)
  Top 0.305: C8.1 5.53,70.92 5.93,71.31 13.78,71.31 18.81,66.28 18.81,63.19 | R21.1 14.25,64.73 | 14.29,64.45 R21.1 | R21.1 14.29,63.18 15.24,62.23 17.84,62.23 18.81,63.19 | IC2.27 51.64,48.69 49.53,50.8 v39.37,50.8 | v24.13,62.23 24.13,62.24 23.48,62.89 S2.1 19.11,62.89 18.81,63.19
  Bottom 0.305: v39.37,50.8 28.67,61.5 24.86,61.5 v24.13,62.23
N$14  (via drill 0.35)
  Top 0.305: R6.1 6.49,43.5 11.27,48.28 18.1,48.28 19.92,50.1 v21.01,50.1 | IC3.3 v25.08,50.14 R9.1
  Bottom 0.305: v21.01,50.1 25.09,50.1 25.13,50.14 v25.08,50.14
N$17  (via drill 0.35)
  Top 0.305: R8.2 43.18,37.78 43.18,39.37 41.91,40.64 v38.1,40.64
  Top 0.406: IC5.5 14.47,45.4 21.51,45.4 v21.59,45.48 | v21.59,43.18 v33.02,43.18
  Bottom 0.305: v38.1,40.64 35.56,40.64 v33.02,43.18
  Bottom 0.406: v21.59,45.48 v21.59,43.18
N$19
  Top 0.305: R7.1 7.62,43.18 9.84,45.4 10.61,45.4 IC5.1
N$20  (via drill 0.35)
  Top 0.305: LED1.C v8.89,31.75 | R7.2 8.51,39.69 8.93,39.27 8.93,38.14 v8.89,38.1
  Bottom 0.305: v8.89,31.75 v8.89,38.1
N$31
  Top 0.305: IC9.4 43.47,14.95 44.45,13.97 44.45,11.07 43.54,10.16 41.44,10.16 | IC9.1 41.23,10.37 41.23,7.7 41.33,7.6 S3.C1
  Top 0.406: 41.44,10.16 IC9.1
N$46  (via drill 0.35)
  Top 0.305: R1.2 28.89,30.5 28.16,31.23 v28.16,33.45 | R16.1 39.69,33.33 37.19,35.82 37.19,36.93 33.77,40.36 v32.11,40.36 | v30.48,36.83 31.13,36.83 31.43,36.53 IC15.3
  Bottom 0.305: v32.11,40.36 32.11,39.73 30.48,38.1 v30.48,36.83 28.16,34.51 v28.16,33.45
N$47  (via drill 0.35)
  Top 0.305: IC15.4 29.53,36.56 29.26,36.83 v27.94,36.83 27.82,36.72 22.45,36.72 15.88,30.14 15.88,24.52 19.86,20.54 22.69,20.54 23.81,21.66 C2.1 | R16.2 41.59,32.8 38.26,36.13 38.26,37.32 34.38,41.2 31.35,41.2 30.78,40.64 v29.21,40.64
  Bottom 0.305: v29.21,40.64 29.21,38.1 v27.94,36.83
OUT-EEG
  Top 0.305: IC3.4 R9.2 23.18,53.2 24.59,54.61 31.75,54.61 33.45,56.31 IC2.8
VFOUT  (via drill 0.35)
  Top 0.305: 45.2,19.18 C7.1 | IC3.1 25.08,47.04 26.4,45.72 v30.48,45.72
  Top 0.406: IC1.4 29.11,18.73 39.59,29.21 45.72,29.21 48.64,26.29 48.64,21.97 46.95,20.28 45.2,20.28 | v39.37,39.37 40.64,38.1 40.64,35.56 41.91,34.29 43.18,34.29 44.45,33.02 v44.45,31.75 | 45.2,20.28 45.2,21.39 R20.2 46.25,21.59 46.99,22.33 v46.99,22.86 | 45.2,20.28 45.2,19.18
  Bottom 0.406: v30.48,45.72 34.29,45.72 39.37,40.64 v39.37,39.37 | v44.45,31.75 45.72,30.48 45.72,25.4 46.99,24.13 v46.99,22.86
VOUT1  (via drill 0.35)
  Top 0.305: 20.95,17.14 v21.59,17.78 | v34.29,27.94 34.29,29.53 C1.1
  Top 0.406: IC7.7 20.95,17.14
  Bottom 0.406: v21.59,17.78 24.13,17.78 26.67,20.32 29.21,20.32 34.29,25.4 v34.29,27.94
VSS  (via drill 0.35)
  Top 0.305: v33.02,35.56 32.37,34.91 IC15.1 | R2.1 8.52,36.83 8.84,36.51 10.7,36.51 | PS1.1 10.7,36.51 | 15.58,39.37 13.57,39.37 10.7,36.51
  Top 0.406: IC1.1 26.16,16.83 25.2,15.88 22.86,15.88 | 22.86,15.88 IC7.6 | R2.1 5.08,36.83 5.08,38.1 4.42,38.76 1.93,38.76 1.22,38.05 1.22,10.79 7.48,4.52 J3.1 10.27,2.65 11.43,3.81 v11.43,12.7 | v22.86,12.7 22.86,15.88 | 15.58,39.37 33.2,39.37 35.48,37.09 35.48,36.33 v35.58,36.23
  Bottom 0.305: v35.58,36.23 34.91,35.56 v33.02,35.56
  Bottom 0.406: v11.43,12.7 v22.86,12.7
(copper drawn outside any net)
  shapes: Top area x888

### Text on the board
tNames: Realizado por: / Valentina Betancourt / Javier Lopez